# EAGLE design untitled (EAGLE 5.06)
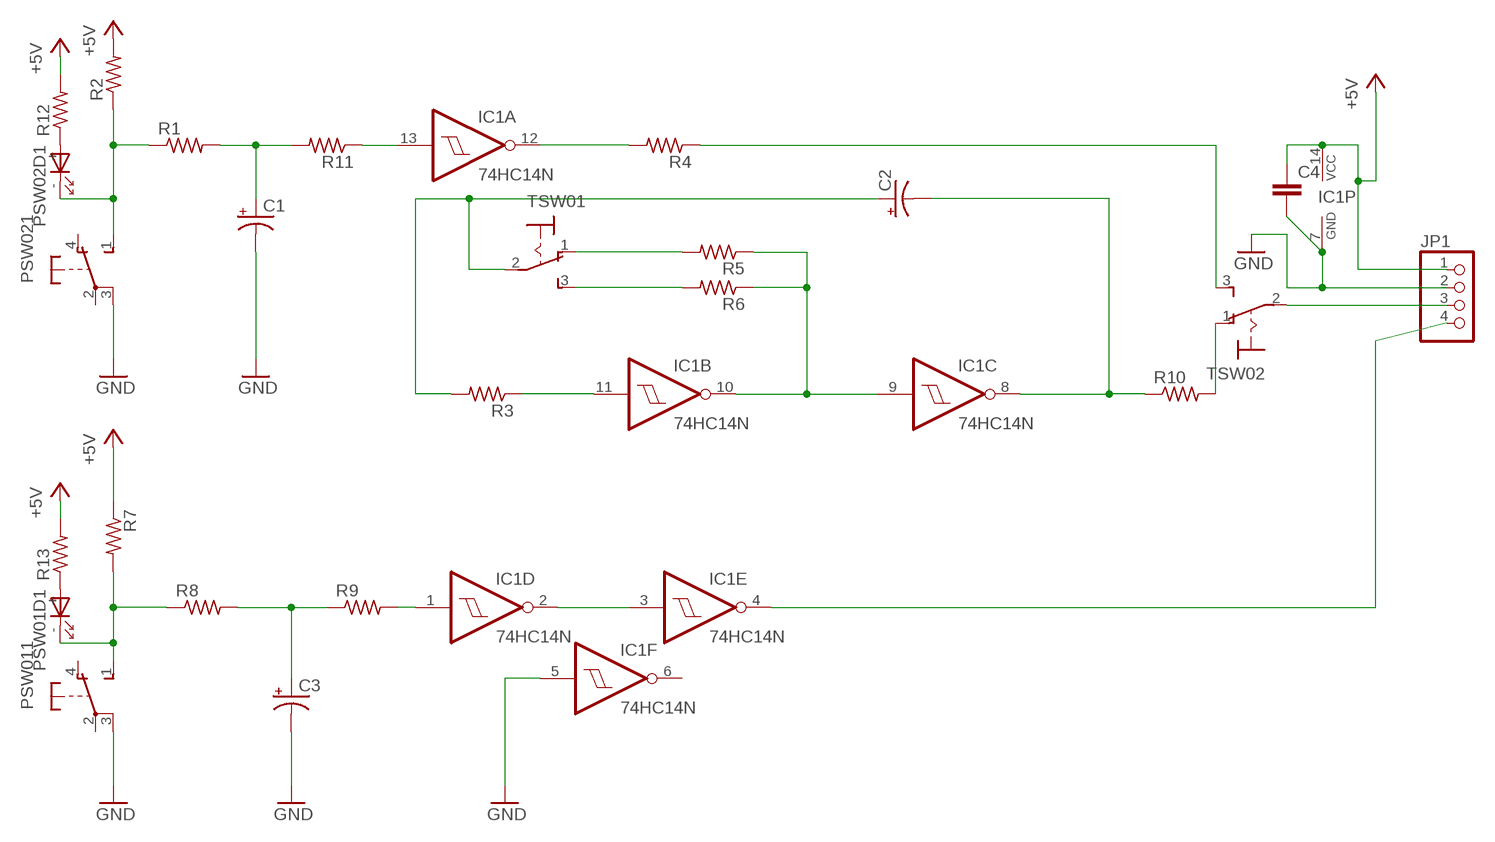
[diagram p0: schematic, sheet 1]

## Parts
C1  CPOL-USTT2D6  [TT2D6]
C2  CPOL-USTT2D6  [TT2D6]
C3  CPOL-USTT2D6  [TT2D6]
C4  C-EU050-030X075  [C050-030X075]
IC1  74HC14N  [DIL14]
JP1  PINHD-1X4  [1X04]
PSW01  SRKL  [SRKL]
PSW02  SRKL  [SRKL]
R1  R-US_0207/10  [0207/10]
R2  R-US_0207/10  [0207/10]
R3  R-US_0207/10  [0207/10]
R4  R-US_0207/10  [0207/10]
R5  R-US_0207/10  [0207/10]
R6  R-US_0207/10  [0207/10]
R7  R-US_0207/10  [0207/10]
R8  R-US_0207/10  [0207/10]
R9  R-US_0207/10  [0207/10]
R10  R-US_0207/10  [0207/10]
R11  R-US_0207/10  [0207/10]
R12  R-US_0207/10  [0207/10]
R13  R-US_0207/10  [0207/10]
TSW01  320-916  [320-916]
TSW02  320-916  [320-916]

## Nets
+5V: C4.1 IC1.14(P:VCC) JP1.1 R2.2 R7.1 R12.2 R13.2
GND: C1.- C3.- C4.2 IC1.5(F:I) IC1.7(P:GND) JP1.2 PSW01.3(1:P) PSW02.3(1:P)
N$1: C1.+ R1.2 R11.2
N$2: IC1.13(A:I) R11.1
N$3: IC1.12(A:O) R4.2
N$4: IC1.9(C:I) IC1.10(B:O) R5.1 R6.1
N$5: IC1.11(B:I) R3.1
N$6: C2.+ R3.2 TSW01.2(P)
N$7: R6.2 TSW01.3(S)
N$8: C2.- IC1.8(C:O) R10.1
N$9: R5.2 TSW01.1(O)
N$10: R10.2 TSW02.1(O)
N$11: C3.+ R8.2 R9.1
N$12: IC1.1(D:I) R9.2
N$13: IC1.2(D:O) IC1.3(E:I)
N$14: PSW02.1(1:S) PSW02.-(D1:C) R1.1 R2.1
N$15: PSW01.1(1:S) PSW01.-(D1:C) R7.2 R8.1
N$16: R4.1 TSW02.3(S)
N$17: JP1.3 TSW02.2(P)
N$18: PSW02.+(D1:A) R12.1
N$19: PSW01.+(D1:A) R13.1
N$148: IC1.4(E:O) JP1.4
Unconnected: IC1.6(F:O) PSW01.2(1:P) PSW01.4(1:O) PSW02.2(1:P) PSW02.4(1:O)

## Library data of the parts
C1-C3 = resistor:CPOL-US: POLARIZED CAPACITOR, American symbol
C4 = resistor:C-EU: CAPACITOR, European symbol
IC1 = 74xx-eu:74*14: Hex schmitt trigger INVERTER
JP1 = pinhead:PINHD-1X4: PIN HEADER
PSW01 PSW02 = switch-misc:SRKL: SWITCH
R1-R13 = resistor:R-US_: RESISTOR, American symbol
TSW01 TSW02 = switch:320-916: TOGGLE SWITCH distributor RS Components

## Board
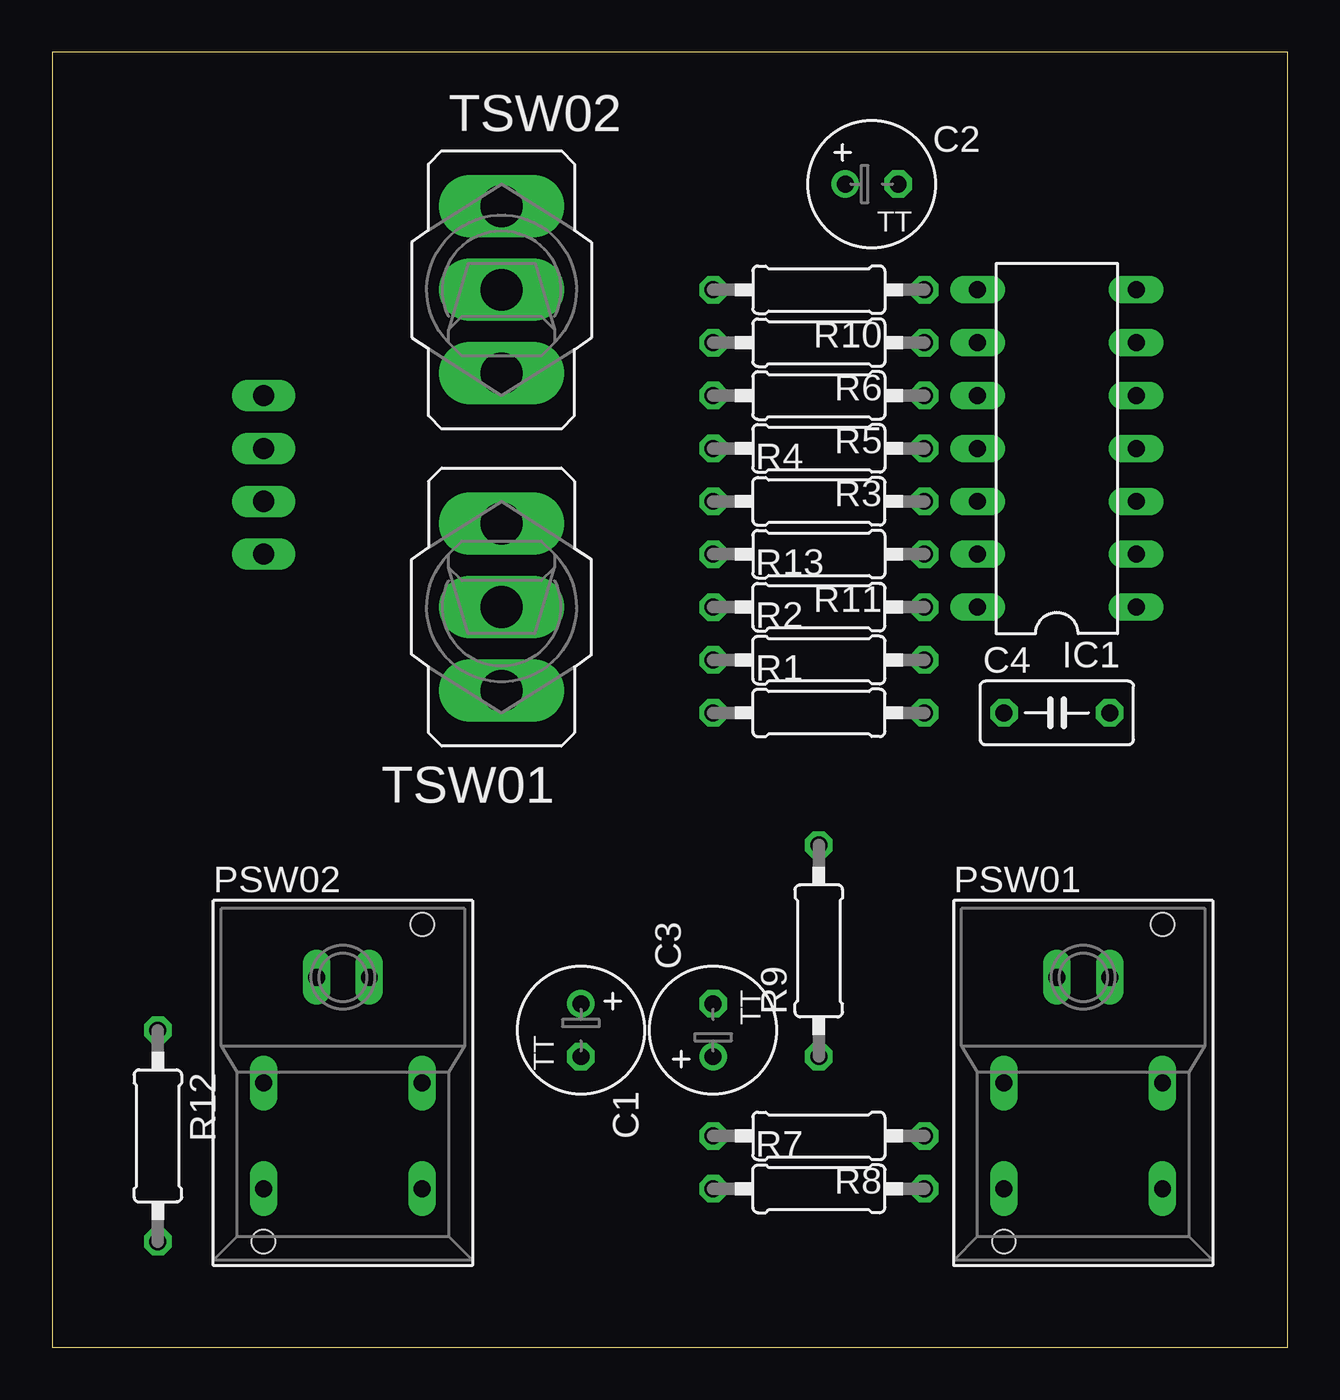
[diagram p1: board, top side]
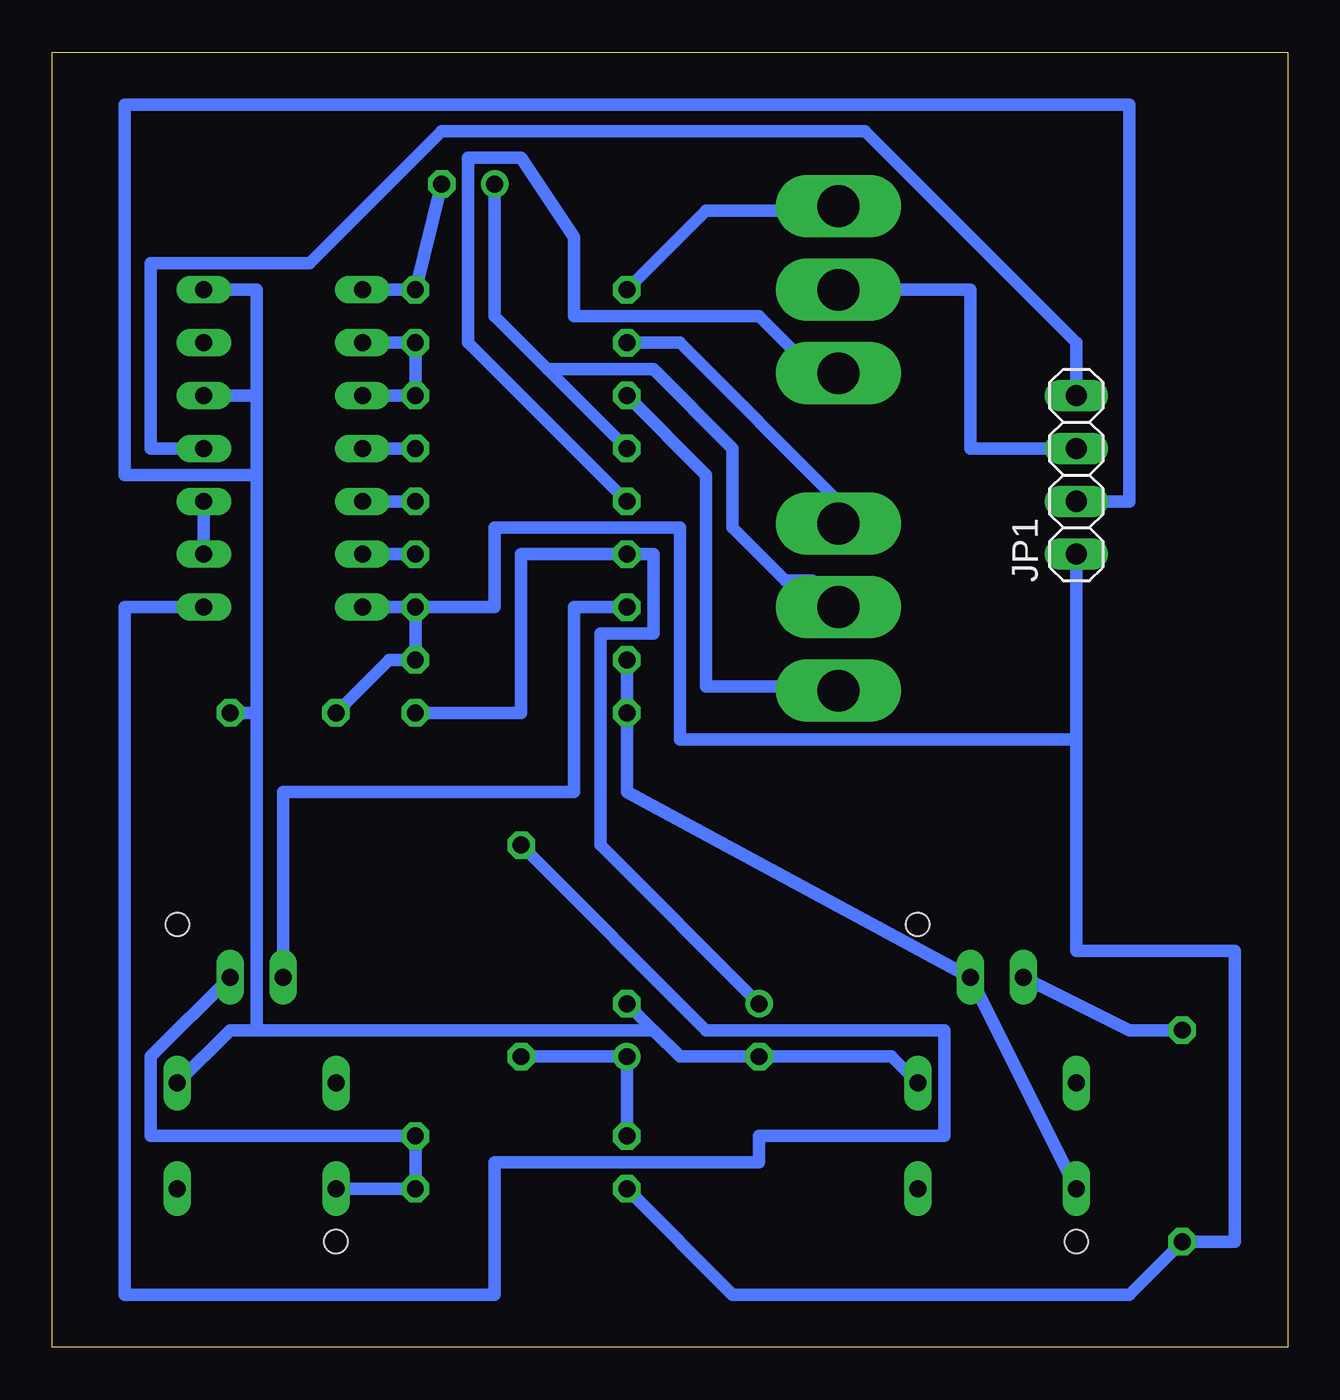
[diagram p2: board, bottom side, seen from below]

Size 59.36 x 62.22 mm. Coordinates in mm from the lower left corner, seen from the top.
Outline: 0,0 59.36,0 59.36,62.22 0,62.22 0,0
Copper layers (1*16): Top 0.035mm / dielectric 1.5mm / Bottom 0.035mm
Design rules "default": minimum track width 10mil, minimum drill 24mil, track to track 8mil, track to pad 8mil, pad to pad 8mil, via to via 8mil, smd to smd 8mil, copper to edge 40mil, drill to drill 8mil, minimum pad ring 10mil, minimum via ring 8mil, stop-mask expansion 4mil, vias tented up to drill 0mil, thermal gap 10mil

### Footprints (pad centres in the part's own frame; a part is rotated, then mirrored left to right if it is on the bottom)
TT2D6 = drill 0.813 round: + -1.27,0 | drill 0.813 octagon: - 1.27,0
C050-030X075 = drill 0.813 octagon: 1 -2.54,0; 2 2.54,0
DIL14 = drill 0.813 long: 1 -7.62,-3.81; 2 -5.08,-3.81; 3 -2.54,-3.81; 4 0,-3.81; 5 2.54,-3.81; 6 5.08,-3.81; 7 7.62,-3.81; 8 7.62,3.81; 9 5.08,3.81; 10 2.54,3.81; 11 0,3.81; 12 -2.54,3.81; 13 -5.08,3.81; 14 -7.62,3.81
1X04 = drill 1.016 long: 1 -3.81,0; 2 -1.27,0; 3 1.27,0; 4 3.81,0
SRKL = drill 0.813 long: 1 -3.81,-5.08; 2 -3.81,0; 3 3.81,0; 4 3.81,-5.08; + -1.27,5.08; - 1.27,5.08 | hole 1.118: 3.81,7.62; -3.81,-7.62
0207/10 = drill 0.813 octagon: 1 -5.08,0; 2 5.08,0
320-916 = drill 2.007 long: 1 0,4.013; 2 0,0; 3 0,-4.013

### Placement (x,y rotation side)
C1  25.4,15.24 270 top
C2  39.37,55.88 0 top
C3  31.75,15.24 90 top
C4  48.26,30.48 0 top
IC1  48.26,43.18 90 top
JP1  10.16,41.91 90 bottom
PSW01  49.53,12.7 0 top
PSW02  13.97,12.7 0 top
R1  36.83,30.48 0 top
R2  36.83,33.02 0 top
R3  36.83,43.18 180 top
R4  36.83,40.64 0 top
R5  36.83,45.72 180 top
R6  36.83,48.26 180 top
R7  36.83,7.62 0 top
R8  36.83,10.16 180 top
R9  36.83,19.05 90 top
R10  36.83,50.8 180 top
R11  36.83,38.1 180 top
R12  5.08,10.16 270 top
R13  36.83,35.56 0 top
TSW01  21.59,35.56 180 top
TSW02  21.59,50.8 0 top

### Tracks (layer width: path | path; a pad name or v marks a point on that pad's centre or on a via)
+5V
  Bottom 0.61: R13.2 R2.2 43.18,33.02 C4.1 | R13.2 IC1.14 | R7.1 26.67,2.54 7.62,2.54 R12.2 2.54,5.08 2.54,19.05 10.16,19.05 10.16,29.21 | 10.16,29.21 JP1.1 | 10.16,29.21 29.21,29.21 29.21,39.37 38.1,39.37 38.1,35.56 R13.2
GND
  Bottom 0.61: 49.53,30.48 C4.2 | 49.53,30.48 49.53,41.91 | 49.53,41.91 49.53,45.72 | 49.53,45.72 49.53,50.8 IC1.7 | 49.53,45.72 IC1.5 | PSW02.3 19.05,13.97 C1.- 29.21,13.97 30.48,15.24 | 30.48,15.24 C3.- | PSW01.3 50.8,15.24 49.53,15.24 | 30.48,15.24 49.53,15.24 | 49.53,15.24 49.53,30.48 | JP1.2 7.62,40.64 7.62,59.69 55.88,59.69 55.88,41.91 49.53,41.91
N$1
  Bottom 0.61: C1.+ 33.02,24.13 33.02,34.29 30.48,34.29 30.48,38.1 R11.2 36.83,38.1 36.83,30.48 R1.2
N$2
  Bottom 0.61: R11.1 IC1.13
N$3
  Bottom 0.61: R4.2 IC1.12
N$4
  Bottom 0.61: IC1.10 R5.1 R6.1 IC1.9
N$5
  Bottom 0.61: R3.1 IC1.11
N$6
  Bottom 0.61: 35.56,46.99 38.1,49.53 C2.+ | 35.56,46.99 R3.2 | TSW01.2 22.86,36.83 24.13,36.83 26.67,39.37 26.67,43.18 30.48,46.99 35.56,46.99
N$7
  Bottom 0.61: R6.2 29.21,48.26 21.59,40.64 TSW01.3
N$8
  Bottom 0.61: IC1.8 R10.1 C2.-
N$9
  Bottom 0.61: R5.2 27.94,41.91 27.94,31.75 21.59,31.75 TSW01.1
N$10
  Bottom 0.61: R10.2 27.94,54.61 21.59,54.61 TSW02.1
N$11
  Bottom 0.61: R8.2 C3.+ R9.1
N$12
  Bottom 0.61: R9.2 27.94,15.24 16.51,15.24 16.51,10.16 25.4,10.16 25.4,8.89 38.1,8.89 38.1,2.54 55.88,2.54 55.88,35.56 IC1.1
N$13
  Bottom 0.61: IC1.2 IC1.3
N$14
  Bottom 0.61: R2.1 R1.1 31.75,26.67 PSW02.- PSW02.1
N$15
  Bottom 0.61: PSW01.1 R7.2 R8.1 54.61,10.16 54.61,13.97 PSW01.-
N$16
  Bottom 0.61: R4.1 39.37,48.26 39.37,57.15 36.83,57.15 34.29,53.34 34.29,49.53 25.4,49.53 22.86,46.99 21.59,46.99 TSW02.3
N$17
  Bottom 0.61: TSW02.2 15.24,50.8 15.24,43.18 JP1.3
N$18
  Bottom 0.61: R12.1 7.62,15.24 PSW02.+
N$19
  Bottom 0.61: R13.1 34.29,35.56 34.29,26.67 48.26,26.67 PSW01.+
N$148
  Bottom 0.61: IC1.4 54.61,43.18 54.61,52.07 46.99,52.07 40.64,58.42 20.32,58.42 10.16,48.26 JP1.4